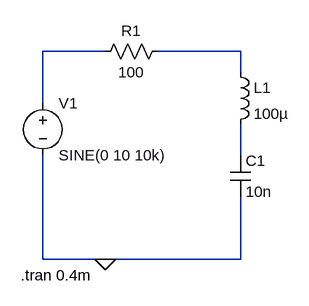
[diagram p0: schematic resonantFrequency.asc]
resonantFrequency.asc, the LTspice schematic file:
Version 4
SHEET 1 880 680
WIRE 144 64 48 64
WIRE 352 64 224 64
WIRE 352 96 352 64
WIRE 48 144 48 64
WIRE 352 224 352 176
WIRE 48 384 48 224
WIRE 144 384 48 384
WIRE 352 384 352 288
WIRE 352 384 144 384
FLAG 144 384 0
SYMBOL res 240 48 R90
WINDOW 0 0 56 VBottom 2
WINDOW 3 32 56 VTop 2
SYMATTR InstName R1
SYMATTR Value 100
SYMBOL cap 336 224 R0
SYMATTR InstName C1
SYMATTR Value 10n
SYMBOL ind 336 80 R0
SYMATTR InstName L1
SYMATTR Value 100µ
SYMBOL voltage 48 128 R0
WINDOW 123 0 0 Left 0
WINDOW 39 0 0 Left 0
SYMATTR InstName V1
SYMATTR Value SINE(0 10 10k)
TEXT 14 408 Left 2 !.tran 0.4m

The netlist it stands for:
* resonantFrequency.asc
R1 N002 N001 100
C1 N003 0 10n
L1 N002 N003 100µ
V1 N001 0 SINE(0 10 10k)
.tran 0.4m
.backanno
.end